# EAGLE design SSX (EAGLE 6.3)
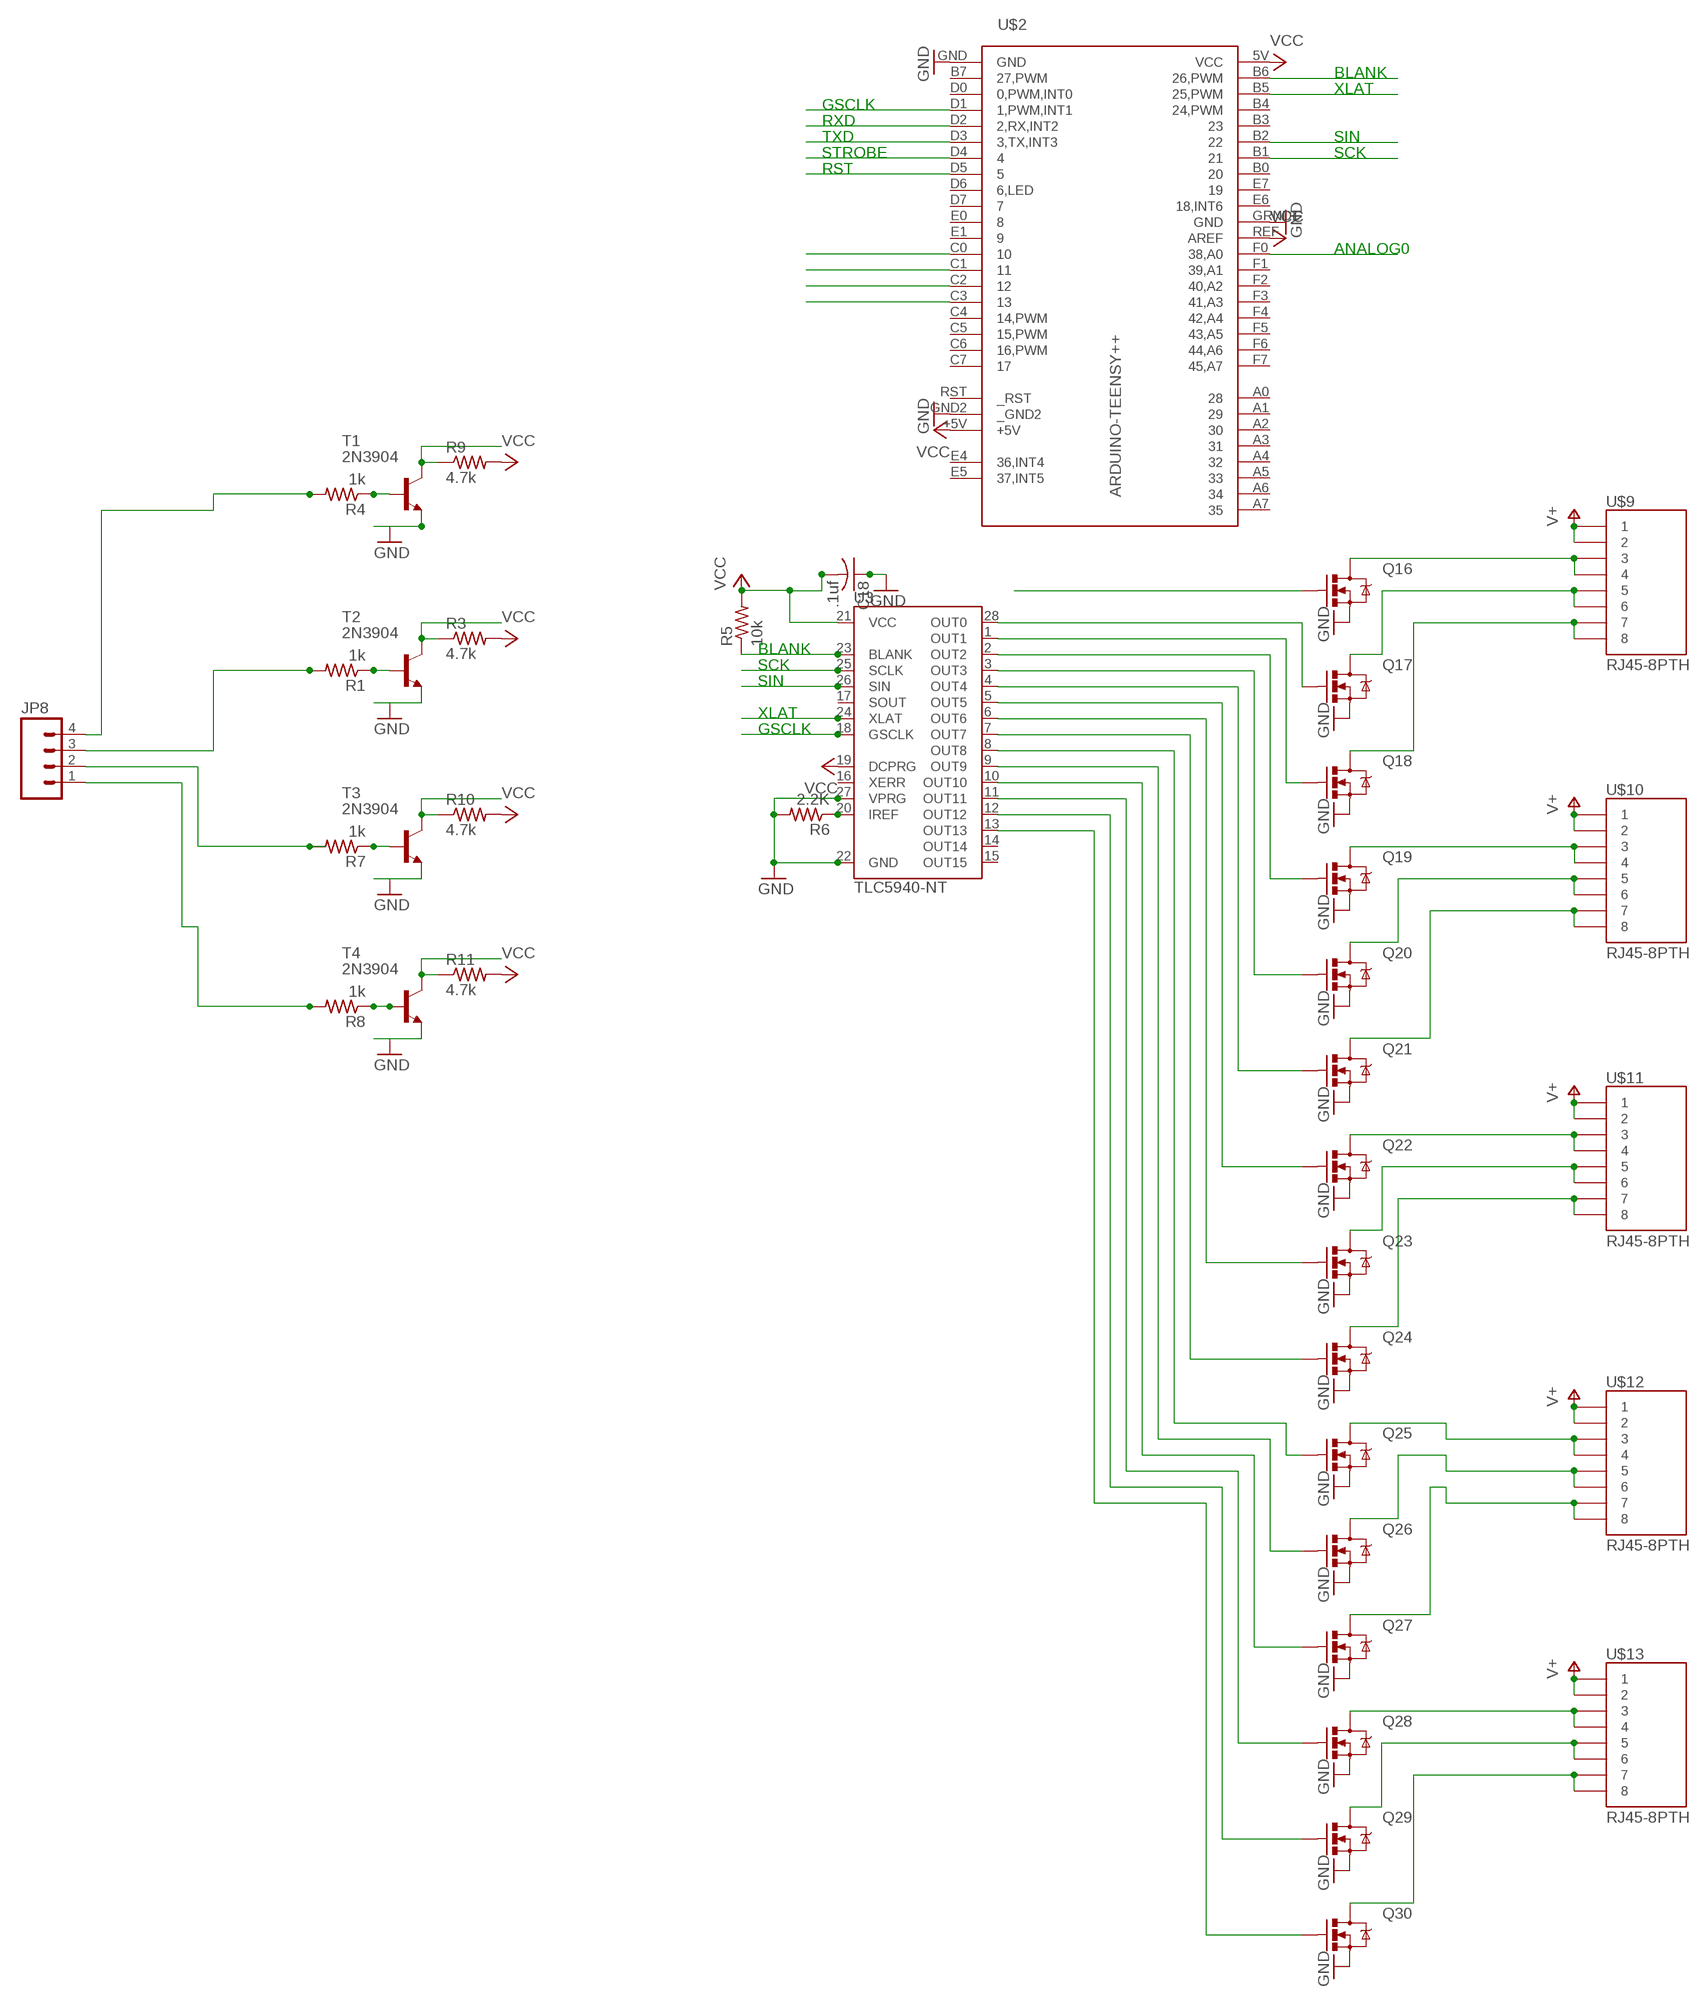
[diagram p0: schematic, sheet 1, part 1 of 2]
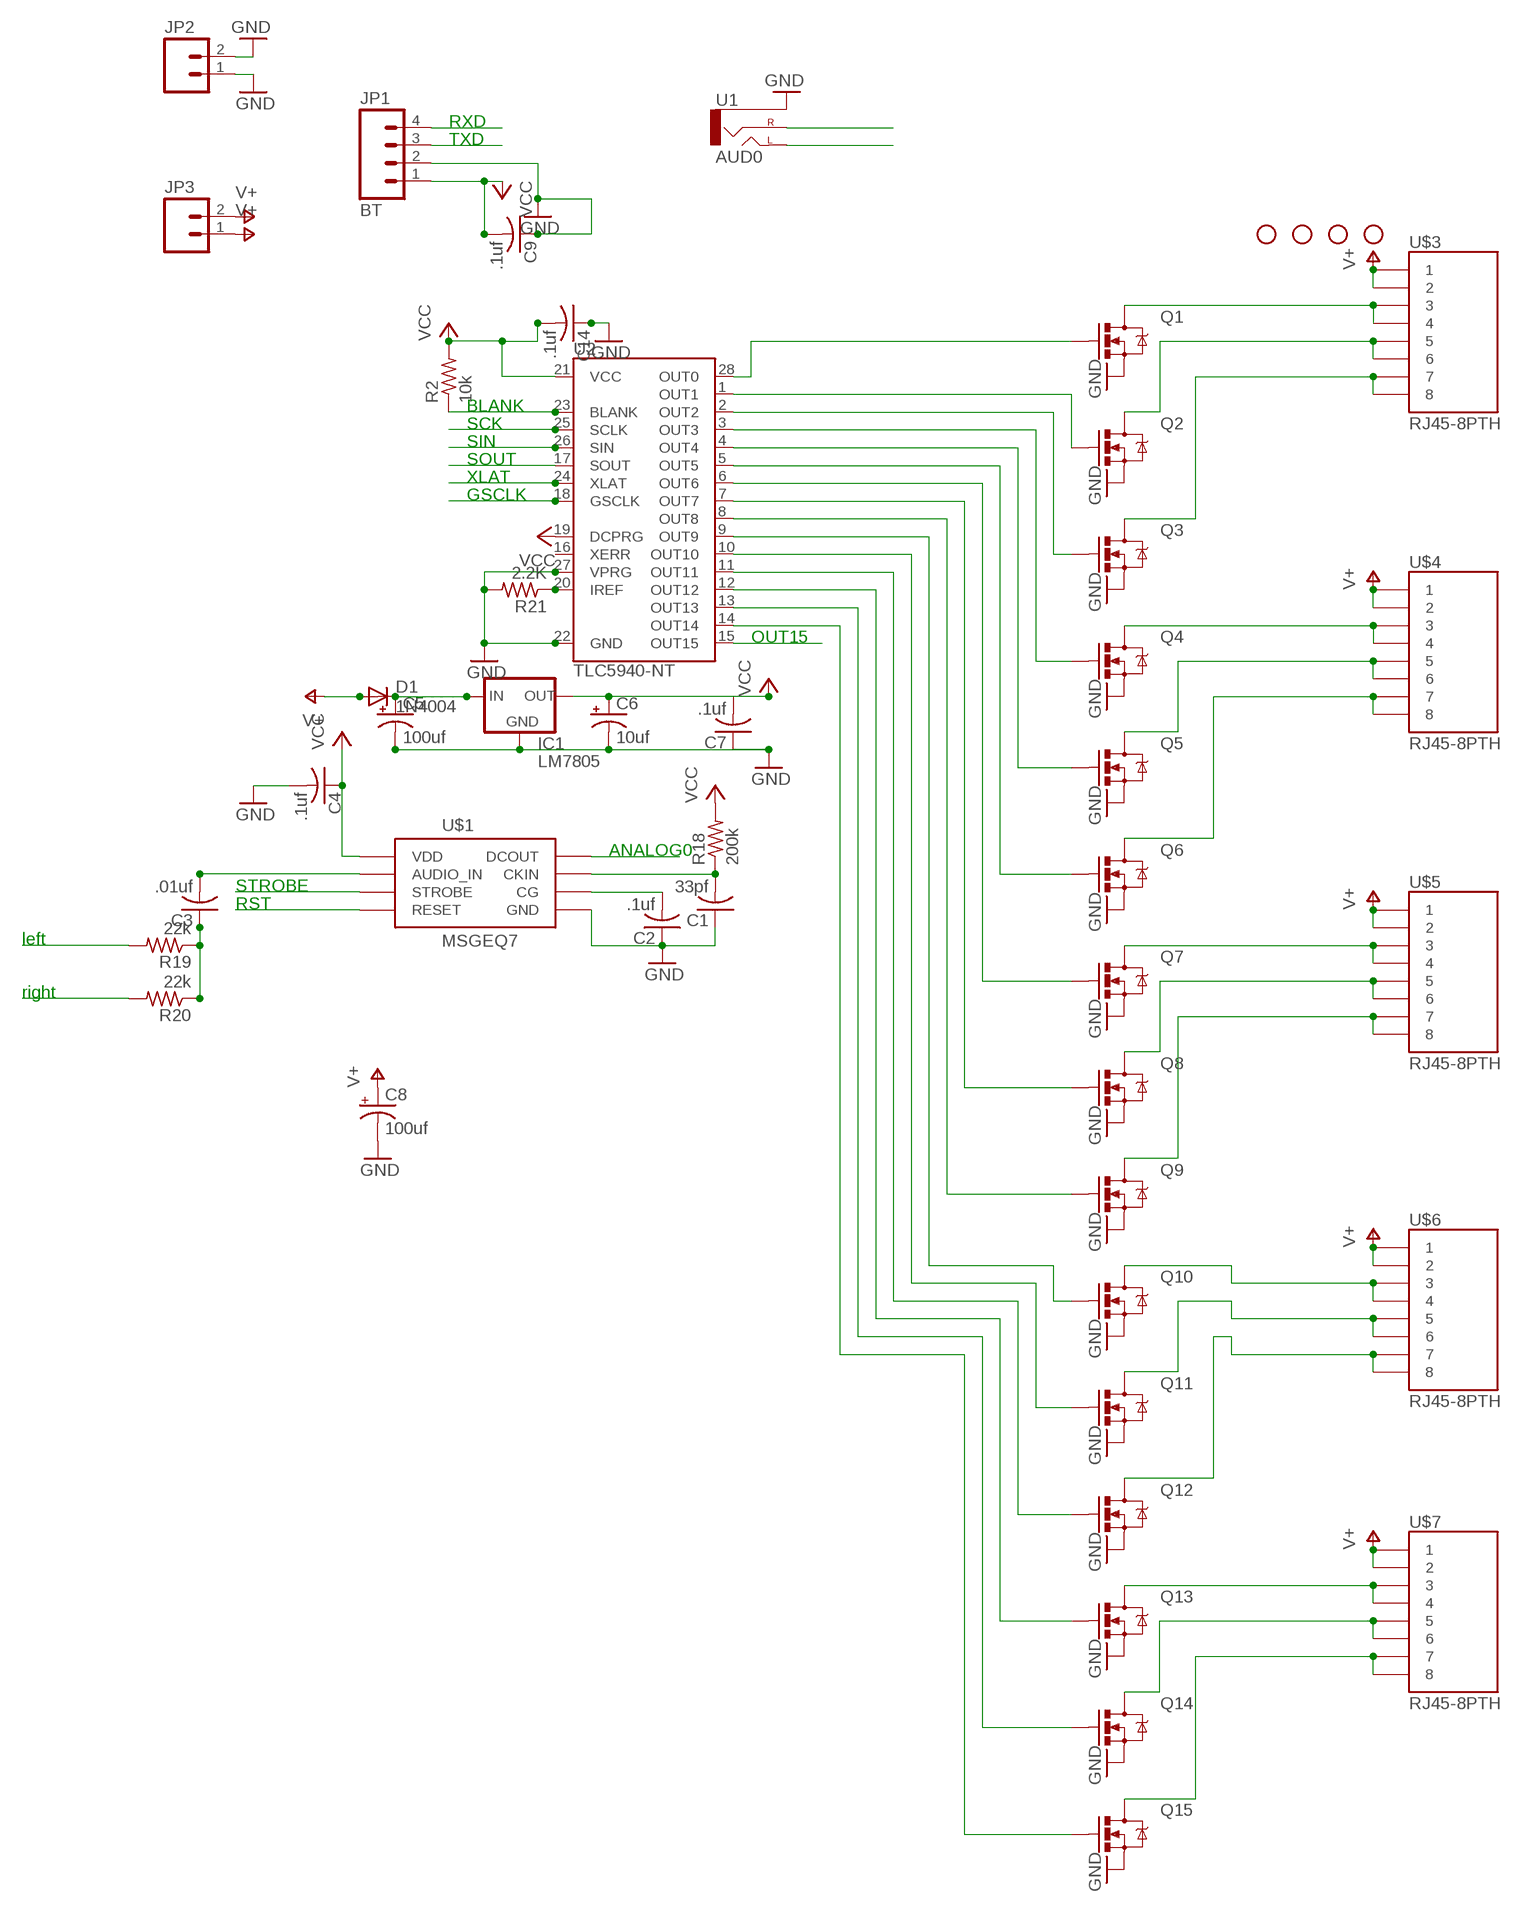
[diagram p1: schematic, sheet 1, part 2 of 2]

## Parts
C1  33pf  C-US025-025X050  [C025-025X050]
C2  .1uf  C-US025-025X050  [C025-025X050]
C3  .01uf  C-US025-025X050  [C025-025X050]
C4  .1uf  C-US025-025X050  [C025-025X050]
C5  100uf  CAP_POLPTH1  [CPOL-RADIAL-100UF-25V]
C6  10uf  CAP_POLPTH2  [CPOL-RADIAL-10UF-25V]
C7  .1uf  C-US025-025X050  [C025-025X050]
C8  100uf  CAP_POLPTH1  [CPOL-RADIAL-100UF-25V]
C9  .1uf  C-US025-025X050  [C025-025X050]
C14  .1uf  C-US025-025X050  [C025-025X050]
C18  .1uf  C-US025-025X050  [C025-025X050]
D1  1N4004  DIODEPTH  [DIODE-1N4001]
IC1  LM7805  V_REG_78XXSINK  [TO220-IGO]
JP1  BT  M04LOCK  [1X04_LOCK]
JP2  M025MM  [SCREWTERMINAL-5MM-2]
JP3  M025MM  [SCREWTERMINAL-5MM-2]
JP4  STAND-OFF  [STAND-OFF]
JP5  STAND-OFF  [STAND-OFF]
JP6  STAND-OFF  [STAND-OFF]
JP7  STAND-OFF  [STAND-OFF]
JP8  M04PTH  [1X04]
Q1  MOSFET-NCHANNELPTH2  [TO220V]
Q2  MOSFET-NCHANNELPTH2  [TO220V]
Q3  MOSFET-NCHANNELPTH2  [TO220V]
Q4  MOSFET-NCHANNELPTH2  [TO220V]
Q5  MOSFET-NCHANNELPTH2  [TO220V]
Q6  MOSFET-NCHANNELPTH2  [TO220V]
Q7  MOSFET-NCHANNELPTH2  [TO220V]
Q8  MOSFET-NCHANNELPTH2  [TO220V]
Q9  MOSFET-NCHANNELPTH2  [TO220V]
Q10  MOSFET-NCHANNELPTH2  [TO220V]
Q11  MOSFET-NCHANNELPTH2  [TO220V]
Q12  MOSFET-NCHANNELPTH2  [TO220V]
Q13  MOSFET-NCHANNELPTH2  [TO220V]
Q14  MOSFET-NCHANNELPTH2  [TO220V]
Q15  MOSFET-NCHANNELPTH2  [TO220V]
Q16  MOSFET-NCHANNELPTH2  [TO220V]
Q17  MOSFET-NCHANNELPTH2  [TO220V]
Q18  MOSFET-NCHANNELPTH2  [TO220V]
Q19  MOSFET-NCHANNELPTH2  [TO220V]
Q20  MOSFET-NCHANNELPTH2  [TO220V]
Q21  MOSFET-NCHANNELPTH2  [TO220V]
Q22  MOSFET-NCHANNELPTH2  [TO220V]
Q23  MOSFET-NCHANNELPTH2  [TO220V]
Q24  MOSFET-NCHANNELPTH2  [TO220V]
Q25  MOSFET-NCHANNELPTH2  [TO220V]
Q26  MOSFET-NCHANNELPTH2  [TO220V]
Q27  MOSFET-NCHANNELPTH2  [TO220V]
Q28  MOSFET-NCHANNELPTH2  [TO220V]
Q29  MOSFET-NCHANNELPTH2  [TO220V]
Q30  MOSFET-NCHANNELPTH2  [TO220V]
R1  1k  R-US_0207/2V  [0207/2V]
R2  10k  R-US_0207/2V  [0207/2V]
R3  4.7k  R-US_0207/2V  [0207/2V]
R4  1k  R-US_0207/2V  [0207/2V]
R5  10k  R-US_0207/2V  [0207/2V]
R6  2.2K  R-US_0207/2V  [0207/2V]
R7  1k  R-US_0207/2V  [0207/2V]
R8  1k  R-US_0207/2V  [0207/2V]
R9  4.7k  R-US_0207/2V  [0207/2V]
R10  4.7k  R-US_0207/2V  [0207/2V]
R11  4.7k  R-US_0207/2V  [0207/2V]
R18  200k  R-US_0207/2V  [0207/2V]
R19  22k  R-US_0207/2V  [0207/2V]
R20  22k  R-US_0207/2V  [0207/2V]
R21  2.2K  R-US_0207/2V  [0207/2V]
T1  2N3904  [TO92]
T2  2N3904  [TO92]
T3  2N3904  [TO92]
T4  2N3904  [TO92]
U1  AUD0  AUDIO-JACKPTH  [AUDIO-JACK]
U2  TLC5940-NT  [DIL28-3]
U3  TLC5940-NT  [DIL28-3]
U$1  MSGEQ7_PTH  [DIL08]
U$2  ARDUINO-TEENSY++  [TEENSY++]
U$3  RJ45-8PTH  [RJ45-8]
U$4  RJ45-8PTH  [RJ45-8]
U$5  RJ45-8PTH  [RJ45-8]
U$6  RJ45-8PTH  [RJ45-8]
U$7  RJ45-8PTH  [RJ45-8]
U$9  RJ45-8PTH  [RJ45-8]
U$10  RJ45-8PTH  [RJ45-8]
U$11  RJ45-8PTH  [RJ45-8]
U$12  RJ45-8PTH  [RJ45-8]
U$13  RJ45-8PTH  [RJ45-8]

## Nets
ANALOG0: U$1.3(DCOUT) U$2.F0(38,A0)
ARS: U$1.7(RESET) U$2.D5
BL: R10.1 T3.1(C) U$2.C1
BLANK: R2.1 U2.23(BLANK) U$2.B6(26,PWM)
BLANK1: R5.1 U3.23(BLANK)
GND: C1.1 C2.1 C4.2 C5.2(-) C6.2(-) C7.1 C8.2(-) C9.1 C14.1 C18.1 IC1.GND JP1.2 JP2.1 JP2.2 Q1.3(S) Q2.3(S) Q3.3(S) Q4.3(S) Q5.3(S) Q6.3(S) Q7.3(S) Q8.3(S) Q9.3(S) Q10.3(S) Q11.3(S) Q12.3(S) Q13.3(S) Q14.3(S) Q15.3(S) Q16.3(S) Q17.3(S) Q18.3(S) Q19.3(S) Q20.3(S) Q21.3(S) Q22.3(S) Q23.3(S) Q24.3(S) Q25.3(S) Q26.3(S) Q27.3(S) Q28.3(S) Q29.3(S) Q30.3(S) R6.2 R21.2 U1.SLEEVE U2.22(GND) U2.27(VPRG) U3.22(GND) U3.27(VPRG) U$1.2(GND) U$2.GND U$2.GND2(_GND2) U$2.GRND1(GND)
GSCLK: U2.18(GSCLK) U$2.D1(1,PWM,INT1)
GSCLK1: U3.18(GSCLK)
HL: R11.1 T4.1(C) U$2.C0
LEFT: R19.2 U1.TIP(LEFT)
LTS: R3.1 T2.1(C) U$2.C2
N$1: Q7.2(D) U$5.3 U$5.4
N$2: Q2.2(D) U$3.5 U$3.6
N$3: Q3.2(D) U$3.7 U$3.8
N$4: Q10.2(D) U$6.3 U$6.4
N$5: Q9.1(G) U2.8(OUT8)
N$6: Q2.1(G) U2.1(OUT1)
N$7: Q3.1(G) U2.2(OUT2)
N$8: Q4.1(G) U2.3(OUT3)
N$9: Q5.2(D) U$4.5 U$4.6
N$10: Q5.1(G) U2.4(OUT4)
N$11: Q6.1(G) U2.5(OUT5)
N$12: Q7.1(G) U2.6(OUT6)
N$13: Q8.1(G) U2.7(OUT7)
N$14: Q17.1(G) U3.28(OUT0)
N$15: Q10.1(G) U2.9(OUT9)
N$16: Q11.1(G) U2.10(OUT10)
N$17: Q12.1(G) U2.11(OUT11)
N$18: Q13.1(G) U2.12(OUT12)
N$19: Q14.1(G) U2.13(OUT13)
N$20: Q15.1(G) U2.14(OUT14)
N$21: Q6.2(D) U$4.7 U$4.8
N$22: Q13.2(D) U$7.3 U$7.4
N$23: Q8.2(D) U$5.5 U$5.6
N$24: C1.2 R18.1 U$1.8(CKIN)
N$25: Q9.2(D) U$5.7 U$5.8
N$26: Q14.2(D) U$7.5 U$7.6
N$27: Q11.2(D) U$6.5 U$6.6
N$28: C3.2 U$1.5(AUDIO_IN)
N$29: Q12.2(D) U$6.7 U$6.8
N$30: Q15.2(D) U$7.7 U$7.8
N$31: Q1.2(D) U$3.3 U$3.4
N$32: C2.2 U$1.6(CG)
N$33: Q4.2(D) U$4.3 U$4.4
N$34: Q1.1(G) U2.28(OUT0)
N$35: R21.1 U2.20(IREF)
N$36: C3.1 R19.1 R20.1
N$37: Q18.1(G) U3.1(OUT1)
N$38: Q19.1(G) U3.2(OUT2)
N$39: Q20.1(G) U3.3(OUT3)
N$40: C5.1(+) D1.C IC1.IN
N$41: Q21.1(G) U3.4(OUT4)
N$42: Q22.1(G) U3.5(OUT5)
N$43: Q23.1(G) U3.6(OUT6)
N$44: Q25.1(G) U3.8(OUT8)
N$45: Q26.1(G) U3.9(OUT9)
N$46: Q27.1(G) U3.10(OUT10)
N$47: Q28.1(G) U3.11(OUT11)
N$48: Q29.1(G) U3.12(OUT12)
N$49: Q30.1(G) U3.13(OUT13)
N$54: R1.1 T2.2(B)
N$55: Q17.2(D) U$9.5 U$9.6
N$56: Q18.2(D) U$9.7 U$9.8
N$57: Q20.2(D) U$10.5 U$10.6
N$58: Q21.2(D) U$10.7 U$10.8
N$59: Q23.2(D) U$11.5 U$11.6
N$60: Q24.2(D) U$11.7 U$11.8
N$61: Q26.2(D) U$12.5 U$12.6
N$62: Q27.2(D) U$12.7 U$12.8
N$63: Q16.2(D) U$9.3 U$9.4
N$64: Q19.2(D) U$10.3 U$10.4
N$65: Q22.2(D) U$11.3 U$11.4
N$66: Q25.2(D) U$12.3 U$12.4
N$67: Q28.2(D) U$13.3 U$13.4
N$68: Q29.2(D) U$13.5 U$13.6
N$69: Q30.2(D) U$13.7 U$13.8
N$70: R4.1 T1.2(B)
N$71: Q24.1(G) U3.7(OUT7)
N$72: R6.1 U3.20(IREF)
N$73: R7.1 T3.2(B)
N$74: R8.1 T4.2(B)
N$75: T4.3(E)
N$80: T3.3(E)
N$81: T2.3(E)
N$82: T1.3(E)
N$83: JP8.4 R4.2
N$84: JP8.3 R1.2
N$85: JP8.2 R7.2
N$86: JP8.1 R8.2
OUT15: Q16.1(G) U2.15(OUT15)
RIGHT: R20.2 U1.RING(RIGHT)
RTS: R9.1 T1.1(C) U$2.C3
RXD: JP1.4 U$2.D3(3,TX,INT3)
SCK: U2.25(SCLK) U$2.B1
SCK1: U3.25(SCLK)
SIN: U2.26(SIN) U$2.B2
SOUT: U2.17(SOUT) U3.26(SIN)
STROBE: U$1.4(STROBE) U$2.D4
TXD: JP1.3 U$2.D2(2,RX,INT2)
V+: C8.1(+) D1.A JP3.1 JP3.2 U$3.1 U$3.2 U$4.1 U$4.2 U$5.1 U$5.2 U$6.1 U$6.2 U$7.1 U$7.2 U$9.1 U$9.2 U$10.1 U$10.2 U$11.1 U$11.2 U$12.1 U$12.2 U$13.1 U$13.2
VCC: C4.1 C6.1(+) C7.2 C9.2 C14.2 C18.2 IC1.OUT JP1.1 R2.2 R3.2 R5.2 R9.2 R10.2 R11.2 R18.2 U2.19(DCPRG) U2.21(VCC) U3.19(DCPRG) U3.21(VCC) U$1.1(VDD) U$2.5V(VCC) U$2.+5V U$2.REF(AREF)
XLAT: U2.24(XLAT) U$2.B5(25,PWM)
XLAT1: U3.24(XLAT)
Unconnected: U2.16(XERR) U3.14(OUT14) U3.15(OUT15) U3.16(XERR) U3.17(SOUT) U$2.A0 U$2.A1 U$2.A2 U$2.A3 U$2.A4 U$2.A5 U$2.A6 U$2.A7 U$2.B0 U$2.B3 U$2.B4(24,PWM) U$2.B7(27,PWM) U$2.C4(14,PWM) U$2.C5(15,PWM) U$2.C6(16,PWM) U$2.C7 U$2.D0(0,PWM,INT0) U$2.D6(6,LED) U$2.D7 U$2.E0 U$2.E1 U$2.E4(36,INT4) U$2.E5(37,INT5) U$2.E6(18,INT6) U$2.E7 U$2.F1(39,A1) U$2.F2(40,A2) U$2.F3(41,A3) U$2.F4(42,A4) U$2.F5(43,A5) U$2.F6(44,A6) U$2.F7(45,A7) U$2.RST(_RST)

## Notes on the sheet
- RXD
- BLANK | TXD
- XLAT
- GSCLK
- RXD
- TXD | SIN
- STROBE | SCK
- RST
- ANALOG0
- BLANK
- SCK
- SIN
- SOUT
- XLAT
- GSCLK
- OUT15
- BLANK
- SCK
- SIN
- XLAT | ANALOG0
- GSCLK
- STROBE
- RST
- left
- right

## Library data of the parts
C1-C4 C7 C9 C14 C18 = resistor:C-US: CAPACITOR, American symbol
C5 C6 C8 = SparkFun:CAP_POL: Capacitor Polarized These are standard SMD and PTH capacitors. Normally 10uF, 47uF, and 100uF in electrolytic and tantalum varieties. Always verify the external diameter of the through hole cap, it varies with capacity, voltage, and manufacturer. The EIA devices should be standard.
D1 = SparkFun:DIODE: Diode These are standard reverse protection diodes and small signal diodes. SMA package can handle up to about 1A. SOD-323 can handle about 200mA. What the SOD-323 package when ordering, there are some mfgs out there that are 5-pin packages.
IC1 = SparkFun:V_REG_78XX: Voltage Regulator Standard 7805 5V regulator. IGO (Input Ground Output). Spark Fun Electronics SKU : COM-00107
JP1 = SparkFun:M04: Header 4 Standard 4-pin 0.1" header. Use with straight break away headers (SKU : PRT-00116), right angle break away headers (PRT-00553), swiss pins (PRT-00743), machine pins (PRT-00117), and female headers (PRT-00115). Molex polarized connector foot print use with SKU : PRT-08231 with associated crimp pins and housings. 1MM SMD Version SKU: PRT-10208
JP2 JP3 = SparkFun:M02: Header 2 Standard 2-pin 0.1" header. Use with straight break away headers (SKU : PRT-00116), right angle break away headers (PRT-00553), swiss pins (PRT-00743), machine pins (PRT-00117), and female headers (PRT-00115). Molex polarized connector foot print use with SKU : PRT-08233 with associated crimp pins and housings.
JP4-JP7 = SparkFun:STAND-OFF: Stand Off This is the mechanical footprint for a #4 phillips button head screw. Use the keepout ring to avoid running the screw head into surrounding components. SKU : PRT-00447
JP8 = SparkFun-Connectors:M04: Header 4 Standard 4-pin 0.1" header. Use with straight break away headers (SKU : PRT-00116), right angle break away headers (PRT-00553), swiss pins (PRT-00743), machine pins (PRT-00117), and female headers (PRT-00115). Molex polarized connector foot print use with SKU : PRT-08231 with associated crimp pins and housings. 1MM SMD Version SKU: PRT-10208
Q1-Q30 = SparkFun:MOSFET-NCHANNEL
R1-R11 R18-R21 = resistor:R-US_: RESISTOR, American symbol
T1-T4 = transistor:2N3904: NPN TRANSISTOR
U1 = SparkFun:AUDIO-JACK: 3.5mm Audio Jack Simple 3.5mm common PCB mount audio jack. SKU: PRT-08032
U2 U3 = SparkFun:TLC5940: TI TLC5940 16-channel LED Driver with Dot Correction and Grayscale PWM Control The TLC5940 is a 16-channel, constant-current sink LED driver. Each channel has an individually adjustable 4096-step grayscale PWM brightness control and a 64-step, constant-current sink (dot correction). The dot correction adjusts the brightness variations between LED channels and other LED drivers. The dot correction data is stored in an integrated EEPROM. Both grayscale control and dot correction are accessible via a serial interface. A single external resistor sets the maximum current value of all 16 channels. Packages: 28-pin HTSSOP 32-pin 5x5mm QFN 28-pin DIP
U$1 = SparkFun:MSGEQ7_PTH
U$2 = tpp:ARDUINO-TEENSY++: Teensy ++ Original Design by Mark Gross Modified Design by Tamir Emran Licensed Under Creative Commons Attribution-ShareAlike 3.0 Unported (CC BY-SA 3.0)
U$3-U$7 U$9-U$13 = SparkFun:RJ45-8: RJ45 Jack Simple RJ45, 8-pin connection - connector for common Cat5, Cat5e, and Cat6 Ethernet cables. Footprint not yet proven in production. Connector sku is PRT-00643; Breakout PCB sku is BOB-00716.

## Board
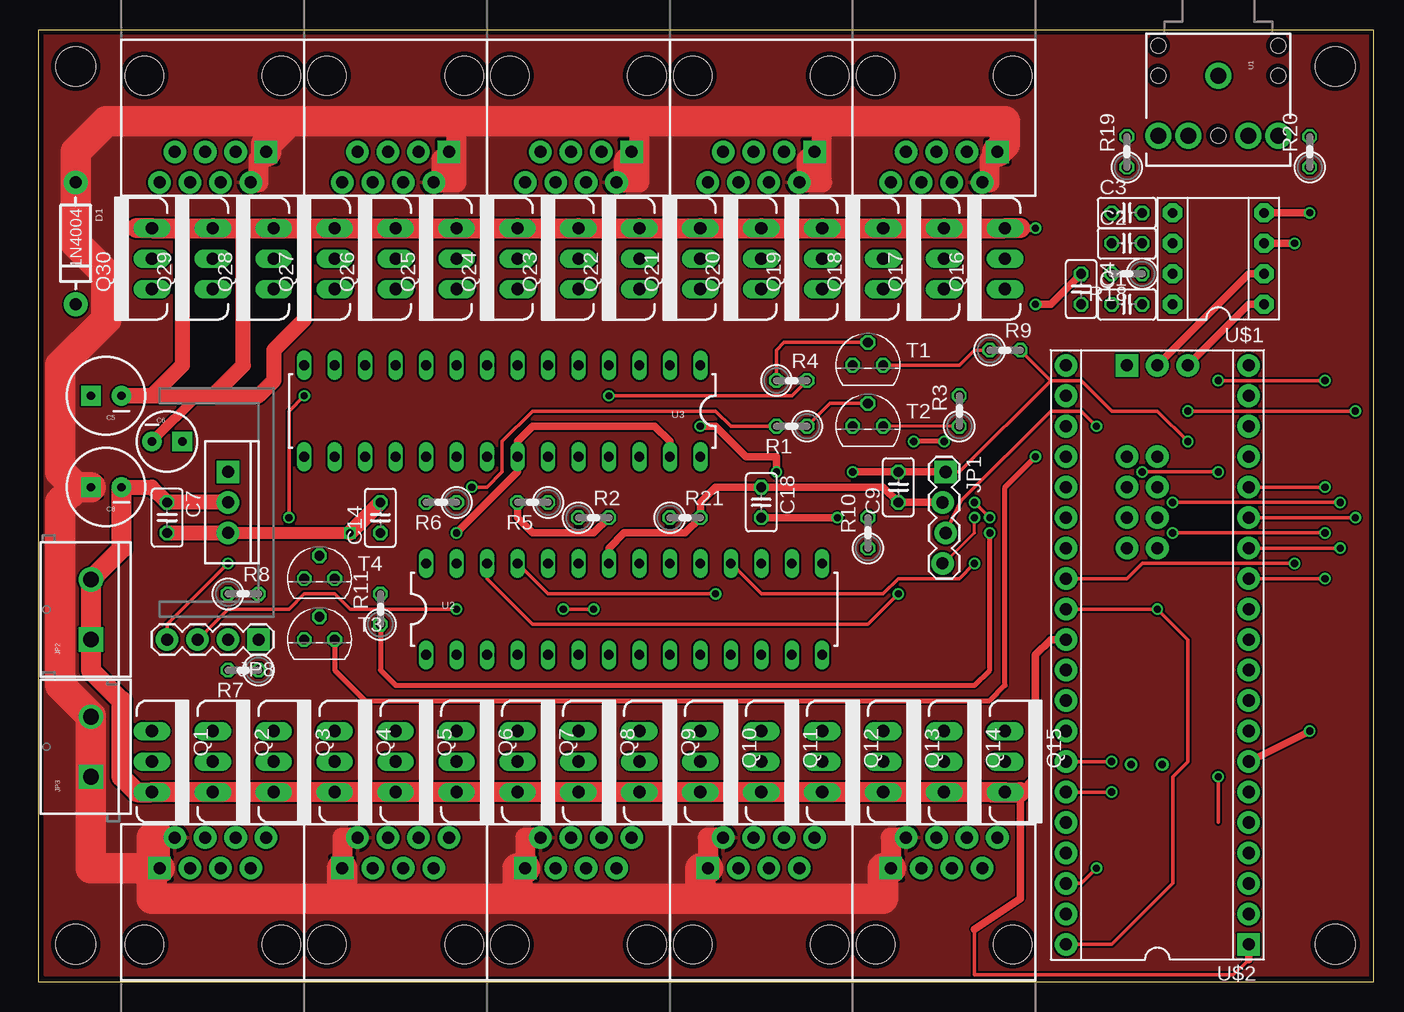
[diagram p2: board, top side]
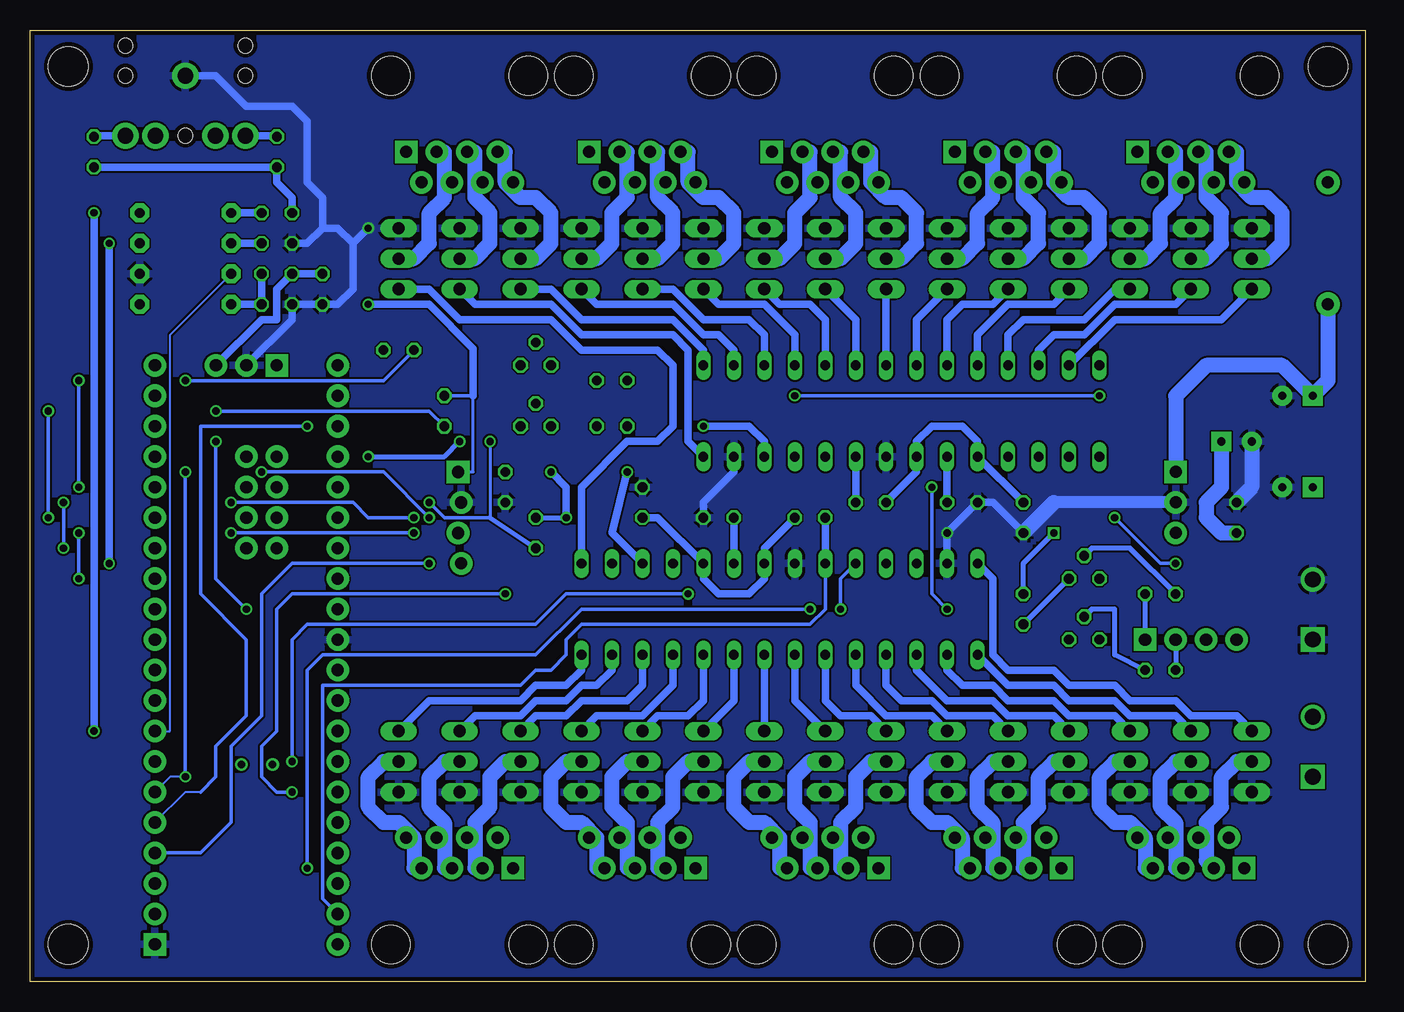
[diagram p3: board, bottom side, seen from below]

Size 111.33 x 79.32 mm. Coordinates in mm from the lower left corner, seen from the top.
Outline: 0,0 111.33,0 111.33,79.32 0,79.32 0,0
Copper layers (1*16): Top 0.0356mm / dielectric 1.5011mm / Bottom 0.0356mm
Design rules "LaenPCBOrder": minimum track width 6mil, minimum drill 13mil, track to track 6mil, track to pad 6mil, pad to pad 6mil, via to via 6mil, smd to smd 6mil, copper to edge 15mil, drill to drill 6mil, minimum pad ring 7mil, minimum via ring 7mil, stop-mask expansion 4mil, vias tented up to drill 0mil, thermal gap 10mil

### Footprints (pad centres in the part's own frame; a part is rotated, then mirrored left to right if it is on the bottom)
C025-025X050 = drill 0.813 octagon: 1 -1.27,0; 2 1.27,0
CPOL-RADIAL-100UF-25V = drill 0.7 pad 1.651 square: 1 1.27,0 | drill 0.7 pad 1.651: 2 -1.27,0
CPOL-RADIAL-10UF-25V = drill 0.7 pad 1.651 square: 1 1.27,0 | drill 0.7 pad 1.651: 2 -1.27,0
DIODE-1N4001 = drill 1 pad 1.981: A -5.08,0; C 5.08,0
TO220-IGO = drill 1 pad 1.88: GND 0,0; OUT 2.54,0 | drill 1 pad 1.88 square: IN -2.54,0
1X04_LOCK = drill 1.016 pad 1.88 square: 1 0,0.127 | drill 1.016 pad 1.88: 2 2.54,-0.127; 3 5.08,0.127; 4 7.62,-0.127
SCREWTERMINAL-5MM-2 = drill 1.3 pad 2.032 square: 1 0,0 | drill 1.3 pad 2.032: 2 5,0
STAND-OFF = hole 3.302: 0,0
1X04 = drill 1.016 pad 1.88 square: 1 0,0 | drill 1.016 pad 1.88: 2 2.54,0; 3 5.08,0; 4 7.62,0
TO220V = drill 1.016 long: 1 -2.54,0; 2 0,0; 3 2.54,0
0207/2V = drill 0.813 octagon: 1 -1.27,0; 2 1.27,0
TO92 = drill 0.813 octagon: 1 1.27,0; 2 0,1.905; 3 -1.27,0
AUDIO-JACK = drill 1.3 pad 2.184: RING 5,5; RSH 5,2.5; SLEEVE 0,0; TIP 5,-5; TSH 5,-2.5 | hole 1.2: 0,5; -2.5,5; -2.5,-5; 0,-5; 5,0
DIL28-3 = drill 0.813 long: 1 -16.51,-3.81; 2 -13.97,-3.81; 3 -11.43,-3.81; 4 -8.89,-3.81; 5 -6.35,-3.81; 6 -3.81,-3.81; 7 -1.27,-3.81; 8 1.27,-3.81; 9 3.81,-3.81; 10 6.35,-3.81; 11 8.89,-3.81; 12 11.43,-3.81; 13 13.97,-3.81; 14 16.51,-3.81; 15 16.51,3.81; 16 13.97,3.81; 17 11.43,3.81; 18 8.89,3.81; 19 6.35,3.81; 20 3.81,3.81; 21 1.27,3.81; 22 -1.27,3.81; 23 -3.81,3.81; 24 -6.35,3.81; 25 -8.89,3.81; 26 -11.43,3.81; 27 -13.97,3.81; 28 -16.51,3.81
DIL08 = drill 0.813 pad 1.6 octagon: 1 -3.81,-3.81; 2 -1.27,-3.81; 3 1.27,-3.81; 4 3.81,-3.81; 5 3.81,3.81; 6 1.27,3.81; 7 -1.27,3.81; 8 -3.81,3.81
TEENSY++ = drill 1.016 pad 1.88: 5V 24.13,-2.54; +5V -24.13,7.62; A0 8.89,0; A1 11.43,0; A2 13.97,0; A3 16.51,0; A4 8.89,2.54; A5 11.43,2.54; A6 13.97,2.54; A7 16.51,2.54; B0 -6.35,7.62; B1 -8.89,7.62; B2 -11.43,7.62; B3 -13.97,7.62; B4 -16.51,7.62; B5 -19.05,7.62; B6 -21.59,7.62; B7 -21.59,-7.62; C0 6.35,-7.62; C1 8.89,-7.62; C2 11.43,-7.62; C3 13.97,-7.62; C4 16.51,-7.62; C5 19.05,-7.62; C6 21.59,-7.62; C7 24.13,-7.62; D0 -19.05,-7.62; D1 -16.51,-7.62; D2 -13.97,-7.62; D3 -11.43,-7.62; D4 -8.89,-7.62; D5 -6.35,-7.62; D6 -3.81,-7.62; D7 -1.27,-7.62; E0 1.27,-7.62; E1 3.81,-7.62; E6 -1.27,7.62; E7 -3.81,7.62; F0 6.35,7.62; F1 8.89,7.62; F2 11.43,7.62; F3 13.97,7.62; F4 16.51,7.62; F5 19.05,7.62; F6 21.59,7.62; F7 24.13,7.62; GND2 24.13,0; GRND1 1.27,7.62; REF 3.81,7.62 | drill 0.635 pad 1.067: E4 -9.144,2.184; E5 -9.144,-0.406 | drill 1.016 pad 1.88 square: GND -24.13,-7.62; RST 24.13,2.54
RJ45-8 = drill 1 pad 1.88 square: 1 -4.445,6.35 | drill 1 pad 1.88: 2 -3.175,8.89; 3 -1.905,6.35; 4 -0.635,8.89; 5 0.635,6.35; 6 1.905,8.89; 7 3.175,6.35; 8 4.445,8.89 | hole 3.2: -5.715,0; 5.715,0

### Placement (x,y rotation side)
C1  90.75,56.46 0 top
C2  90.75,61.54 0 top
C3  90.75,64.08 0 top
C4  86.94,57.73 270 top
C5  5.66,48.84 180 top
C6  10.74,45.03 0 top
C7  10.74,38.68 270 top
C8  5.66,41.22 180 top
C9  71.7,41.22 90 top
C14  28.52,38.68 90 top
C18  60.27,39.95 270 top
D1  3.12,61.54 270 top
IC1  15.82,39.95 270 top
JP1  75.51,42.49 270 top
JP2  4.39,28.52 90 top
JP3  4.39,17.09 90 top
JP4  108.13,76.28 0 top
JP5  3.12,76.28 0 top
JP6  108.13,3.12 0 top
JP7  3.12,3.12 0 top
JP8  18.36,28.52 180 top
Q1  9.47,18.36 270 top
Q2  14.55,18.36 270 top
Q3  19.63,18.36 270 top
Q4  24.71,18.36 270 top
Q5  29.79,18.36 270 top
Q6  34.87,18.36 270 top
Q7  39.95,18.36 270 top
Q8  45.03,18.36 270 top
Q9  50.11,18.36 270 top
Q10  55.19,18.36 270 top
Q11  60.27,18.36 270 top
Q12  65.35,18.36 270 top
Q13  70.43,18.36 270 top
Q14  75.51,18.36 270 top
Q15  80.59,18.36 270 top
Q16  80.59,60.27 90 top
Q17  75.51,60.27 90 top
Q18  70.43,60.27 90 top
Q19  65.35,60.27 90 top
Q20  60.27,60.27 90 top
Q21  55.19,60.27 90 top
Q22  50.11,60.27 90 top
Q23  45.03,60.27 90 top
Q24  39.95,60.27 90 top
Q25  34.87,60.27 90 top
Q26  29.79,60.27 90 top
Q27  24.71,60.27 90 top
Q28  19.63,60.27 90 top
Q29  14.55,60.27 90 top
Q30  9.47,60.27 90 top
R1  62.81,46.3 180 top
R2  46.3,38.68 0 top
R3  76.78,47.57 90 top
R4  62.81,50.11 0 top
R5  41.22,39.95 180 top
R6  33.6,39.95 180 top
R7  17.09,25.98 180 top
R8  17.09,32.33 0 top
R9  80.59,52.65 0 top
R10  69.16,37.41 90 top
R11  28.52,31.06 90 top
R18  90.75,59 180 top
R19  90.75,69.16 90 top
R20  105.99,69.16 90 top
R21  53.92,38.68 0 top
T1  69.16,51.38 0 top
T2  69.16,46.3 0 top
T3  23.44,28.52 0 top
T4  23.44,33.6 0 top
U1  98.37,75.51 270 top
U2  48.84,31.06 0 top
U3  38.68,47.57 180 top
U$1  98.37,60.27 90 top
U$2  93.29,27.25 90 top
U$3  14.55,3.12 0 top
U$4  29.79,3.12 0 top
U$5  45.03,3.12 0 top
U$6  60.27,3.12 0 top
U$7  75.51,3.12 0 top
U$9  75.51,75.51 180 top
U$10  60.27,75.51 180 top
U$11  45.03,75.51 180 top
U$12  29.79,75.51 180 top
U$13  14.55,75.51 180 top

### Tracks (layer width: path | path; a pad name or v marks a point on that pad's centre or on a via)
ANALOG0  (via drill 0.6)
  Top 0.305: v104.72,34.87 92.02,34.87 90.75,33.6 U$2.F0
  Top 0.61: U$1.3 v104.72,61.54
  Bottom 0.61: v104.72,61.54 v104.72,34.87
ARS
  Bottom 0.152: U$1.7 99.64,53.92 99.64,20.9 U$2.D5
BL  (via drill 0.6)
  Top 0.305: v78.05,39.95 v79.32,38.68 | v94.56,39.95 v108.53,39.95 | v108.53,36.14 U$2.C1
  Top 0.406: T3.1 24.71,25.98 27.25,23.44 79.32,23.44 80.59,24.71 80.59,41.22 v83.13,43.76 | v75.51,45.03 v72.97,45.03
  Bottom 0.254: v72.97,45.03 72.97,38.68
  Bottom 0.305: 72.97,38.68 76.78,38.68 v78.05,39.95 | v79.32,38.68 83.13,38.68 84.4,39.95 v94.56,39.95 | v108.53,36.14 v108.53,39.95
  Bottom 0.406: v83.13,43.76 76.78,43.76 v75.51,45.03 | 72.97,38.68 R10.1
BLANK
  Bottom 0.305: U$2.B6 86.94,6.93 86.94,24.71 70.43,24.71 69.16,25.98 67.89,25.98 66.62,27.25 66.62,28.52 65.35,29.79 46.3,29.79 45.03,31.06 U2.23
  Bottom 0.61: U2.23 R2.1
BLANK1
  Bottom 0.61: U3.23 R5.1
GND  (via drill 0.6)
  Top 0.305: 78.05,4.39 78.05,0.58 99.64,0.58 100.91,1.85
  Top 0.61: v83.13,62.81 Q16.3 | v34.87,37.41 39.95,42.49 U3.22 39.95,45.03 41.22,46.3 51.38,46.3 52.65,45.03 U3.27 | U2.22 47.57,36.14 48.84,37.41 53.92,37.41 R21.2 55.19,39.95 56.46,41.22 C18.1 70.43,41.22 C9.1 JP1.2 | 78.05,4.39 81.86,6.93 81.86,15.82 83.13,17.09 83.13,27.25 84.4,28.52 U$2.GRND1 | 100.91,1.85 U$2.GND | U$1.2 100.91,59 U$2.GND2
  Top 0.813: 13.28,48.84 C6.2
  Top 1.27: IC1.GND C7.1 9.47,41.22 C8.2 | 8.2,62.81 12.01,62.81 12.01,51.38 9.47,48.84 C5.2 14.55,48.84 17.09,51.38 17.09,62.81 22.17,62.81 22.17,55.19 19.63,52.65 19.63,50.11 18.36,48.84 13.28,48.84
  Top 1.676: 8.2,62.81 Q30.3 12.01,62.81 Q29.3 17.09,62.81 Q28.3 22.17,62.81 Q27.3 Q26.3 Q25.3 Q24.3 Q23.3 Q22.3 Q21.3 Q20.3 Q19.3 Q18.3 Q17.3 Q16.3 81.86,62.81 | Q15.3 81.86,15.82 | 79.32,15.82 Q15.3 | Q15.3 Q14.3 Q13.3 Q12.3 Q11.3 Q10.3 Q9.3 Q8.3 Q7.3 Q6.3 Q5.3 Q4.3 Q3.3 Q2.3 Q1.3 8.2,15.82 6.93,17.09 6.93,23.44 4.39,25.98 JP2.1 JP2.2 6.93,36.06 C8.2
  Bottom 0.61: C1.1 C4.2 | U1.SLEEVE 95.83,75.51 93.29,72.97 89.48,72.97 88.21,71.7 88.21,66.62 86.94,65.35 86.94,62.81 | 86.94,62.81 88.21,61.54 C2.1 | C1.1 85.67,56.46 84.4,57.73 84.4,61.54 | 84.4,61.54 85.67,62.81 86.94,62.81 | U3.27 52.65,42.49 55.19,39.95 R21.2 | U2.27 v34.87,37.41 R6.2 31.06,39.95 C14.1 | 84.4,61.54 v83.13,62.81 | C1.1 89.48,55.19 U$2.GND2
  Bottom 1.016: IC1.GND 25.98,39.95
  Bottom 1.27: C6.2 9.47,41.22 C7.1 | 25.98,39.95 C14.1
  pour Bottom: 0.58,79.32 111.07,79.32 111.07,-0.69 0.58,-0.69
GSCLK  (via drill 0.6)
  Top 0.305: U2.18 60.27,32.33 70.43,32.33 71.7,33.6 76.78,33.6 v78.05,34.87
  Bottom 0.305: v78.05,34.87 89.48,34.87 92.02,32.33 92.02,22.17 94.56,19.63 94.56,13.28 97.1,10.74 U$2.D1
HL  (via drill 0.6)
  Top 0.305: v94.56,37.41 v107.26,37.41 | v107.26,33.6 U$2.C0
  Top 0.406: R11.1 28.52,25.98 29.79,24.71 78.05,24.71 79.32,25.98 v79.32,37.41
  Bottom 0.305: v79.32,37.41 v94.56,37.41 | v107.26,37.41 v107.26,33.6
  Bottom 0.406: T4.1 R11.1
LEFT
  Bottom 0.61: U1.TIP 90.83,70.51 R19.2
LTS  (via drill 0.6)
  Top 0.254: R3.1 T2.1
  Top 0.305: U$2.C2 v109.8,38.68 | v109.8,47.57 v95.83,47.57
  Bottom 0.305: v109.8,38.68 v109.8,47.57 | v95.83,47.57 78.05,47.57 R3.1
N$1
  Bottom 1.27: 43.76,12.01 43.76,13.28 42.49,14.55 42.49,17.09 41.22,18.36 Q7.2 | 43.76,12.01 43.76,9.47 U$5.3 | U$5.4 43.76,12.01
N$2
  Bottom 1.27: 15.82,12.01 15.82,13.28 17.09,14.55 17.09,17.09 15.82,18.36 Q2.2 | 15.82,12.01 15.82,9.47 U$3.5 | U$3.6 15.82,12.01
N$3
  Bottom 1.27: 18.36,12.01 19.63,13.28 20.9,13.28 22.17,14.55 22.17,17.09 20.9,18.36 Q3.2 | 18.36,12.01 18.36,9.47 U$3.7 | U$3.8 18.36,12.01
N$4
  Bottom 1.27: 59,12.01 59,13.28 57.73,14.55 57.73,17.09 56.46,18.36 Q10.2 | 59,12.01 59,9.47 U$6.3 | U$6.4 59,12.01
N$5
  Bottom 0.61: Q9.1 U2.8
N$6
  Bottom 0.61: U2.1 29.79,24.71 25.98,24.71 24.71,23.44 20.9,23.44 19.63,22.17 15.82,22.17 Q2.1
N$7
  Bottom 0.61: U2.2 34.87,25.98 33.6,24.71 31.06,24.71 29.79,23.44 25.98,23.44 24.71,22.17 20.9,22.17 Q3.1
N$8
  Bottom 0.61: U2.3 37.41,25.98 34.87,23.44 31.06,23.44 29.79,22.17 25.98,22.17 Q4.1
N$9
  Bottom 1.27: 31.06,12.01 31.06,13.28 32.33,14.55 32.33,17.09 31.06,18.36 Q5.2 | 31.06,12.01 31.06,9.47 U$4.5 | U$4.6 31.06,12.01
N$10
  Bottom 0.61: U2.4 39.95,24.71 38.68,23.44 36.14,23.44 34.87,22.17 31.06,22.17 Q5.1
N$11
  Bottom 0.61: U2.5 42.49,24.71 39.95,22.17 36.14,22.17 Q6.1
N$12
  Bottom 0.61: U2.6 45.03,23.44 43.76,22.17 41.22,22.17 Q7.1
N$13
  Bottom 0.61: U2.7 47.57,23.44 Q8.1
N$14
  Bottom 0.61: U3.28 56.46,45.03 56.46,52.65 57.73,53.92 65.35,53.92 67.89,56.46 74.24,56.46 Q17.1
N$15
  Bottom 0.61: U2.9 52.65,23.44 Q10.1
N$16
  Bottom 0.61: Q11.1 59,22.17 56.46,22.17 55.19,23.44 U2.10
N$17
  Bottom 0.61: Q12.1 64.08,22.17 60.27,22.17 57.73,24.71 U2.11
N$18
  Bottom 0.61: U2.12 60.27,24.71 61.54,23.44 65.35,23.44 66.62,22.17 69.16,22.17 Q13.1
N$19
  Bottom 0.61: U2.13 62.81,25.98 64.08,24.71 65.35,24.71 66.62,23.44 69.16,23.44 70.43,22.17 74.24,22.17 Q14.1
N$20
  Bottom 0.61: U2.14 65.35,25.98 66.62,24.71 69.16,24.71 70.43,23.44 78.05,23.44 Q15.1
N$21
  Bottom 1.27: 33.6,12.01 34.87,13.28 36.14,13.28 37.41,14.55 37.41,17.09 36.14,18.36 Q6.2 | 33.6,12.01 33.6,9.47 U$4.7 | U$4.8 33.6,12.01
N$22
  Bottom 1.27: 74.24,12.01 74.24,13.28 72.97,14.55 72.97,17.09 71.7,18.36 Q13.2 | 74.24,12.01 74.24,9.47 U$7.3 | U$7.4 74.24,12.01
N$23
  Bottom 1.27: 46.3,12.01 46.3,13.28 47.57,14.55 47.57,17.09 46.3,18.36 Q8.2 | 46.3,12.01 46.3,9.47 U$5.5 | U$5.6 46.3,12.01
N$24
  Bottom 0.61: R18.1 C1.2 U$1.8
N$25
  Bottom 1.27: 48.84,12.01 50.11,13.28 51.38,13.28 52.65,14.55 52.65,17.09 51.38,18.36 Q9.2 | 48.84,12.01 48.84,9.47 U$5.7 | U$5.8 48.84,12.01
N$26
  Bottom 1.27: 76.78,12.01 76.78,13.28 78.05,14.55 78.05,17.09 76.78,18.36 Q14.2 | 76.78,12.01 76.78,9.47 U$7.5 | U$7.6 76.78,12.01
N$27
  Bottom 1.27: 61.54,12.01 61.54,13.28 62.81,14.55 62.81,17.09 61.54,18.36 Q11.2 | 61.54,12.01 61.54,9.47 U$6.5 | U$6.6 61.54,12.01
N$28
  Bottom 0.61: C3.2 U$1.5
N$29
  Bottom 1.27: 64.08,12.01 65.35,13.28 66.62,13.28 67.89,14.55 67.89,17.09 66.62,18.36 Q12.2 | 64.08,12.01 64.08,9.47 U$6.7 | U$6.8 64.08,12.01
N$30
  Bottom 1.27: 79.32,12.01 80.59,13.28 81.86,13.28 83.13,14.55 83.13,17.09 81.86,18.36 Q15.2 | 79.32,12.01 79.32,9.47 U$7.7 | U$7.8 79.32,12.01
N$31
  Bottom 1.27: 13.28,12.01 13.28,13.28 12.01,14.55 12.01,17.09 10.74,18.36 Q1.2 | 13.28,12.01 13.28,10.11 U$3.3 | U$3.4 13.28,12.01
N$32
  Bottom 0.61: U$1.6 C2.2
N$33
  Bottom 1.27: 28.52,12.01 28.52,13.28 27.25,14.55 27.25,17.09 25.98,18.36 Q4.2 | 28.52,12.01 28.52,9.47 U$4.3 | U$4.4 28.52,12.01
N$34
  Bottom 0.61: U2.28 31.06,33.6 31.06,27.25 29.79,25.98 25.98,25.98 24.71,24.71 20.9,24.71 19.63,23.44 15.82,23.44 14.55,22.17 10.74,22.17 Q1.1
N$35
  Bottom 0.61: R21.1 U2.20
N$36
  Bottom 0.61: R20.1 R19.1 90.75,66.62 89.48,65.35 C3.1
N$37
  Bottom 0.61: U3.1 55.19,52.65 57.73,55.19 65.35,55.19 67.89,57.73 Q18.1
N$38
  Bottom 0.61: U3.2 52.65,52.65 53.92,53.92 55.19,53.92 57.73,56.46 64.08,56.46 Q19.1
N$39
  Bottom 0.61: U3.3 50.11,53.92 51.38,55.19 55.19,55.19 57.73,57.73 Q20.1
N$40
  Bottom 1.27: D1.C 3.12,50.11 C5.1 6.93,51.38 13.28,51.38 15.82,48.84 IC1.IN
N$41
  Bottom 0.61: U3.4 47.57,53.92 50.11,56.46 53.92,56.46 Q21.1
N$42
  Bottom 0.61: U3.5 45.03,55.19 46.3,56.46 48.84,56.46 Q22.1
N$43
  Bottom 0.61: U3.6 42.49,55.19 Q23.1
N$44
  Bottom 0.61: U3.8 37.41,55.19 Q25.1
N$45
  Bottom 0.61: U3.9 34.87,55.19 33.6,56.46 31.06,56.46 Q26.1
N$46
  Bottom 0.61: U3.10 32.33,53.92 29.79,56.46 25.98,56.46 Q27.1
N$47
  Bottom 0.61: U3.11 29.79,53.92 28.52,55.19 23.44,55.19 20.9,57.73 Q28.1
N$48
  Bottom 0.61: U3.12 27.25,52.65 25.98,53.92 23.44,53.92 20.9,56.46 15.82,56.46 Q29.1
N$49
  Bottom 0.61: U3.13 20.9,55.19 12.01,55.19 Q30.1
N$54
  Top 0.305: T2.2 65.99,48.21 R1.1
N$55
  Bottom 1.27: 74.24,66.62 74.24,65.35 72.97,64.08 72.97,61.54 74.24,60.27 Q17.2 | 74.24,66.62 74.24,69.16 U$9.5 | U$9.6 74.24,66.62
N$56
  Bottom 1.27: Q18.2 69.16,60.27 67.89,61.54 67.89,64.08 69.16,65.35 70.43,65.35 71.7,66.62 | 71.7,66.62 71.7,69.16 U$9.7 | U$9.8 71.7,66.62
N$57
  Bottom 1.27: Q20.2 59,60.27 57.73,61.54 57.73,64.08 59,65.35 59,66.62 | 59,66.62 59,69.16 U$10.5 | U$10.6 59,66.62
N$58
  Bottom 1.27: Q21.2 53.92,60.27 52.65,61.54 52.65,64.08 53.92,65.35 55.19,65.35 56.46,66.62 | 56.46,66.62 56.46,69.16 U$10.7 | U$10.8 56.46,66.62
N$59
  Bottom 1.27: Q23.2 43.76,60.27 42.49,61.54 42.49,64.08 43.76,65.35 43.76,66.62 | 43.76,66.62 43.76,69.16 U$11.5 | U$11.6 43.76,66.62
N$60
  Bottom 1.27: Q24.2 38.68,60.27 37.41,61.54 37.41,64.08 38.68,65.35 39.95,65.35 41.22,66.62 | 41.22,66.62 41.22,69.16 U$11.7 | U$11.8 41.22,66.62
N$61
  Bottom 1.27: Q26.2 28.52,60.27 27.25,61.54 27.25,64.08 28.52,65.35 28.52,66.62 | 28.52,66.62 28.52,69.16 U$12.5 | U$12.6 28.52,66.62
N$62
  Bottom 1.27: Q27.2 23.44,60.27 22.17,61.54 22.17,64.08 23.44,65.35 24.71,65.35 25.98,66.62 | 25.98,66.62 25.98,69.16 U$12.7 | U$12.8 25.98,66.62
N$63
  Bottom 1.27: 76.78,66.62 76.78,65.35 78.05,64.08 78.05,61.54 79.32,60.27 Q16.2 | 76.78,66.62 76.78,69.16 U$9.3 | U$9.4 76.78,66.62
N$64
  Bottom 1.27: Q19.2 64.08,60.27 62.81,61.54 62.81,64.08 61.54,65.35 61.54,66.62 | 61.54,66.62 61.54,69.16 U$10.3 | U$10.4 61.54,66.62
N$65
  Bottom 1.27: Q22.2 48.84,60.27 47.57,61.54 47.57,64.08 46.3,65.35 46.3,66.62 | 46.3,66.62 46.3,69.16 U$11.3 | U$11.4 46.3,66.62
N$66
  Bottom 1.27: Q25.2 33.6,60.27 32.33,61.54 32.33,64.08 31.06,65.35 31.06,66.62 | 31.06,66.62 31.06,69.16 U$12.3 | U$12.4 31.06,66.62
N$67
  Bottom 1.27: 15.82,66.62 15.82,65.35 17.09,64.08 17.09,61.54 18.36,60.27 Q28.2 | 15.82,66.62 15.82,69.16 U$13.3 | U$13.4 15.82,66.62
N$68
  Bottom 1.27: Q29.2 13.28,60.27 12.01,61.54 12.01,64.08 13.28,65.35 13.28,65.99 | 13.28,65.99 13.28,69.16 U$13.5 | 13.28,65.99 U$13.6
N$69
  Bottom 1.27: Q30.2 8.2,60.27 6.93,61.54 6.93,64.08 8.2,65.35 9.47,65.35 10.74,66.62 | 10.74,66.62 10.74,69.16 U$13.7 | U$13.8 10.74,66.62
N$70
  Top 0.305: T1.2 62.18,53.29 61.54,52.65 R4.1
N$71
  Bottom 0.61: U3.7 Q24.1
N$72
  Bottom 0.61: U3.20 R6.1
N$73
  Bottom 0.406: R7.1 20.9,27.25 20.9,31.06 22.81,31.06 T3.2
N$74
  Bottom 0.406: R8.1 19.63,36.14 22.81,36.14 T4.2
N$83  (via drill 0.6)
  Top 0.305: R4.2 62.81,48.84 v47.57,48.84 | JP8.4 10.74,29.79 v15.82,34.87 | v20.9,38.68 20.9,47.57 v22.17,48.84
  Bottom 0.305: v15.82,34.87 17.09,34.87 v20.9,38.68 | v22.17,48.84 v47.57,48.84
N$84  (via drill 0.6)
  Top 0.305: R1.2 57.73,46.3 56.46,47.57 41.22,47.57 38.68,45.03 38.68,42.49 37.41,41.22 v36.14,41.22 | JP8.3 15.82,31.06 20.9,31.06 22.17,32.33 24.71,32.33 25.98,31.06 v34.87,31.06
  Bottom 0.305: v36.14,41.22 36.14,32.33 v34.87,31.06
N$85
  Bottom 0.406: JP8.2 R7.2
N$86
  Bottom 0.406: JP8.1 R8.2
OUT15
  Bottom 0.61: U2.15 65.35,41.22 61.54,45.03 59,45.03 57.73,46.3 57.73,51.38 59,52.65 65.35,52.65 67.89,55.19 75.51,55.19 78.05,57.73 Q16.1
RIGHT
  Bottom 0.61: U1.RING 105.91,70.51 R20.2
RTS  (via drill 0.6)
  Top 0.305: R9.1 78.05,52.65 76.78,51.38 T1.1 | v98.37,50.11 v107.26,50.11 | v107.26,41.22 U$2.C3
  Bottom 0.305: R9.1 81.86,50.11 v98.37,50.11 | v107.26,50.11 v107.26,41.22
RXD  (via drill 0.6)
  Top 0.254: JP1.4 75.51,34.87 78.05,37.41 v78.05,38.68
  Top 0.305: v92.02,42.49 v98.37,42.49 | v98.37,17.09 98.37,13.28
  Bottom 0.152: U$2.D3 99.64,17.09 v98.37,17.09
  Bottom 0.305: v78.05,38.68 81.86,42.49 v92.02,42.49 | v98.37,42.49 v98.37,17.09
SCK  (via drill 0.6)
  Top 0.305: U2.25 42.49,32.33 v56.46,32.33 | v89.48,18.36 U$2.B1
  Bottom 0.305: v56.46,32.33 66.62,32.33 69.16,29.79 88.21,29.79 89.48,28.52 v89.48,18.36
SIN  (via drill 0.6)
  Top 0.305: U2.26 37.41,33.6 41.22,29.79 69.16,29.79 v71.7,32.33 | v89.48,15.82 U$2.B2
  Bottom 0.305: v71.7,32.33 89.48,32.33 90.75,31.06 90.75,20.9 92.02,19.63 92.02,17.09 90.75,15.82 v89.48,15.82
SOUT  (via drill 0.6)
  Top 0.61: v55.19,46.3 56.46,46.3 59,43.76 61.54,43.76 v61.54,42.49
  Bottom 0.61: U3.26 50.11,45.03 51.38,46.3 v55.19,46.3 | v61.54,42.49 62.81,37.41 U2.17
STROBE  (via drill 0.6)
  Top 0.61: U$1.4 v105.99,64.08 | v105.99,20.9 U$2.D4
  Bottom 0.61: v105.99,64.08 v105.99,20.9
TXD  (via drill 0.6)
  Top 0.305: JP1.3 76.91,40.08 84.4,47.57 86.94,47.57 v88.21,46.3
  Bottom 0.152: U$2.D2 98.37,15.82 97.1,15.82
  Bottom 0.305: v88.21,46.3 97.1,46.3 97.1,32.33 93.29,28.52 93.29,22.17 95.83,19.63 95.83,17.09 97.1,15.82
V+
  Top 1.676: U$9.2 79.32,66.62 79.32,68.53 U$9.1 | U$10.1 64.08,68.53 64.08,66.62 U$10.2 65.35,66.62 65.35,71.7 | U$11.1 48.84,68.53 48.84,66.62 U$11.2 50.11,66.62 50.11,71.7 | U$12.2 33.6,66.62 | U$12.1 33.6,68.53 33.6,66.62 | U$13.2 18.36,66.62 18.36,68.53 U$13.1 | 33.6,66.62 34.87,66.62 34.87,71.7 | U$7.2 71.07,12.01 U$7.1 | U$6.2 55.83,12.01 U$6.1 | U$5.2 40.59,12.01 U$5.1 | U$4.2 25.35,12.01 U$4.1 | U$3.2 10.11,12.01 U$3.1 | JP3.2 4.39,22.17
  Top 2.54: U$13.1 19,69.8 20.9,71.7 | 20.9,71.7 34.87,71.7 50.11,71.7 65.35,71.7 80.59,71.7 80.59,69.8 U$9.1 | 20.9,71.7 5.66,71.7 3.12,69.16 D1.A 3.12,61.54 5.66,59 5.66,55.19 1.85,51.38 1.85,42.49 3.12,41.22 | U$3.1 9.47,9.47 | 9.47,9.47 9.47,6.93 25.35,6.93 | 25.35,6.93 U$4.1 | U$5.1 39.95,9.47 39.95,6.93 | 39.95,6.93 25.35,6.93 | U$6.1 55.19,9.47 55.19,6.93 | 55.19,6.93 39.95,6.93 | U$7.1 70.43,9.47 70.43,6.93 55.19,6.93 | 10.11,12.01 9.47,12.01 9.47,9.47 | 9.47,9.47 4.39,9.47 JP3.1 JP3.2 | 4.39,22.17 1.85,24.71 1.85,39.95 3.12,41.22 | C8.1 3.12,41.22
  pour Top: 111.07,79.32 111.07,0.58 0.58,0.58 0.58,79.32
VCC  (via drill 0.6)
  Top 0.305: JP1.1 76.78,42.49 84.4,50.11 | 84.4,50.11 86.94,50.11 89.48,47.57 93.29,47.57 v95.83,45.03 | U$2.REF v93.29,31.06 95.83,28.52 95.83,18.36 94.56,17.09 94.56,8.2 89.48,3.12 U$2.+5V | R9.2 84.4,50.11
  Top 0.61: R5.2 39.95,38.68 41.22,37.41 46.3,37.41 R2.2 | C18.2 v66.62,38.68 | v67.89,42.49 C9.2 JP1.1 | v83.13,56.46 84.4,56.46 C4.1 | U$1.1 100.91,56.46 U$2.5V
  Top 1.016: IC1.OUT v25.98,37.41
  Top 1.27: C7.2 IC1.OUT | v25.98,37.41 C14.2
  Bottom 0.254: JP1.1 74.37,42.49 74.37,48.84
  Bottom 0.305: v95.83,45.03 95.83,33.6 v93.29,31.06 | R3.2 74.37,48.84
  Bottom 0.406: R11.2 28.52,34.87 v25.98,37.41 | R10.2 v66.62,38.68
  Bottom 0.61: C4.1 R18.2 90.75,57.73 90.75,55.19 92.02,55.19 U$2.5V | R5.2 37.41,42.49 U3.21 37.41,45.03 36.14,46.3 33.6,46.3 32.33,45.03 U3.19 C14.2 | C18.2 59,38.68 U2.19 55.19,33.6 53.92,32.33 51.38,32.33 50.11,33.6 U2.21 50.11,36.14 R2.2 | v66.62,38.68 66.62,41.22 v67.89,42.49 | 74.37,48.84 74.37,52.78 78.05,56.46 v83.13,56.46
  Bottom 1.27: C6.1 12.01,41.22 13.28,39.95 13.28,38.68 12.01,37.41 C7.2
XLAT  (via drill 0.6)
  Top 0.305: U$2.B5 86.94,8.2 v88.21,9.47 | v46.3,31.06 v43.76,31.06
  Bottom 0.305: v88.21,9.47 88.21,25.98 86.94,27.25 69.16,27.25 65.35,31.06 v46.3,31.06 | v43.76,31.06 43.76,33.6 U2.24